# Altium schematic sheet DWM_Display.SchDoc
size A4; SheetNumber: 3; SheetTotal: 3
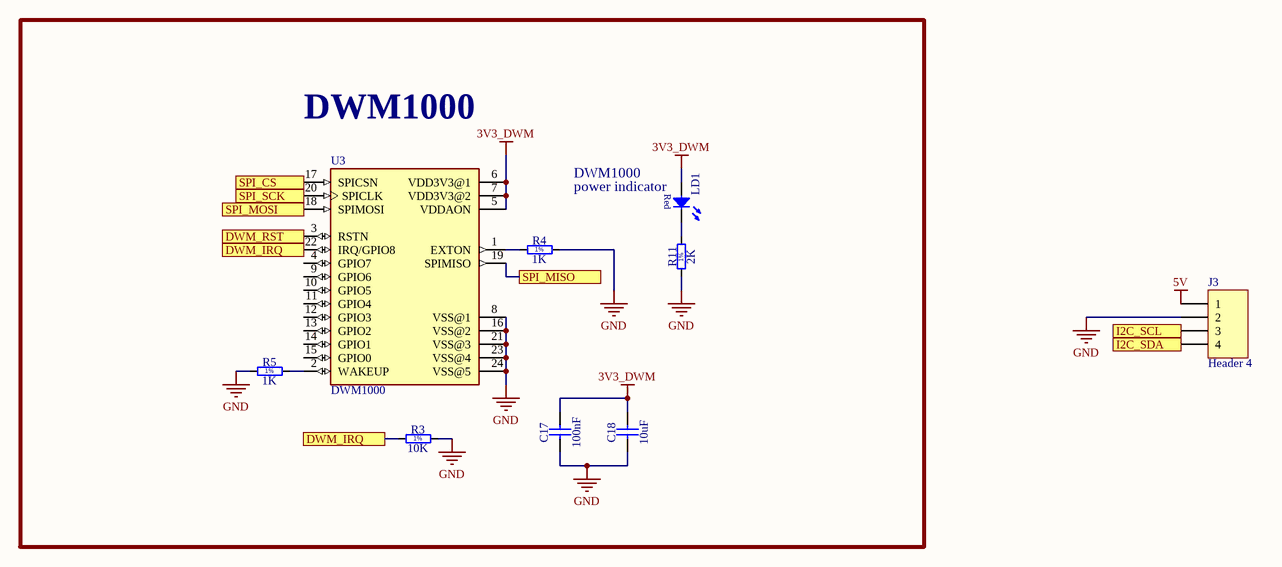
[diagram p0: DWM_Display.SchDoc]

## Parts
C17  100nF  [0603C]
C18  10uF  [0603C]
J3  Header 4  [HDR1X4]
LD1  (no value)  [0603 LED]
R3  10K  [0603R]
R4  1K  [0603R]
R5  1K  [0603R]
R11  2K  [0603R]
U3  DWM1000  [XCVR_DWM1000]

## Blocks framed on the sheet
DWM1000: C17 C18 LD1 R3-R5 R11 U3

## Ports
DWM_IRQ, DWM_RST, I2C_SCL, I2C_SDA, SPI_CS, SPI_MISO, SPI_MOSI, SPI_SCK

## Nets
3V3_DWM: C17.2 C18.2 LD1.2(A) U3.5(VDDAON) U3.6(VDD3V3@1) U3.7(VDD3V3@2)
5V: J3.1
GND: C17.1 C18.1 J3.2 R3.2 R4.2 R5.1 R11.1 U3.8(VSS@1) U3.16(VSS@2) U3.21(VSS@3) U3.23(VSS@4) U3.24(VSS@5)
DWM_IRQ: R3.1 U3.22(IRQ/GPIO8) ; port DWM_IRQ
DWM_RST: U3.3(RSTN) ; port DWM_RST
I2C_SCL: J3.3 ; port I2C_SCL
I2C_SDA: J3.4 ; port I2C_SDA
SPI_CS: U3.17(SPICSN) ; port SPI_CS
SPI_MISO: U3.19(SPIMISO) ; port SPI_MISO
SPI_MOSI: U3.18(SPIMOSI) ; port SPI_MOSI
SPI_SCK: U3.20(SPICLK) ; port SPI_SCK
NetLD1_1: LD1.1(C) R11.2
NetR4_1: R4.1 U3.1(EXTON)
NetR5_2: R5.2 U3.2(WAKEUP)

Not connected (* = marked no-connect by the designer): U3 4(GPIO7) 9(GPIO6) 10(GPIO5) 11(GPIO4) 12(GPIO3) 13(GPIO2) 14(GPIO1) 15(GPIO0)

## Notes on the sheet
- DWM1000
- (near LD1) power indicator
- (in symbol LED Red 1C 2A) Red
- (in symbol Resistor - 1%_1) 1%

## Library data of the parts
C17 C18 = Capacitor - non polarized: Non-polarised capacitor
J3 = Header 4: Header, 4-Pin; LatestRevisionDate: 17-Jul-2002; LatestRevisionNote: Re-released for DXP Platform.; Publisher: Altium Limited
LD1 = LED Red 1C 2A
R3-R5 R11 = Resistor - 1%_1: Resistor - 1%
U3 = DWM1000: 802.15.4 IR-UWB Transceiver Module 3.5GHz ~ 6.5GHz Integrated, Chip Surface Mount; MF: Decawave Limited; Package: Module Decawave; Availability: Unavailable; Value: *; MP: DWM1000; SnapEDA_Link: https://www.snapeda.com/parts/DWM1000/Decawave%20Limited/view-part/327593/?ref=snap; Price: None